# EAGLE design LB_BIT_3IN_3OUT-LARGE-v03(1_1x) (EAGLE 6.5.0)
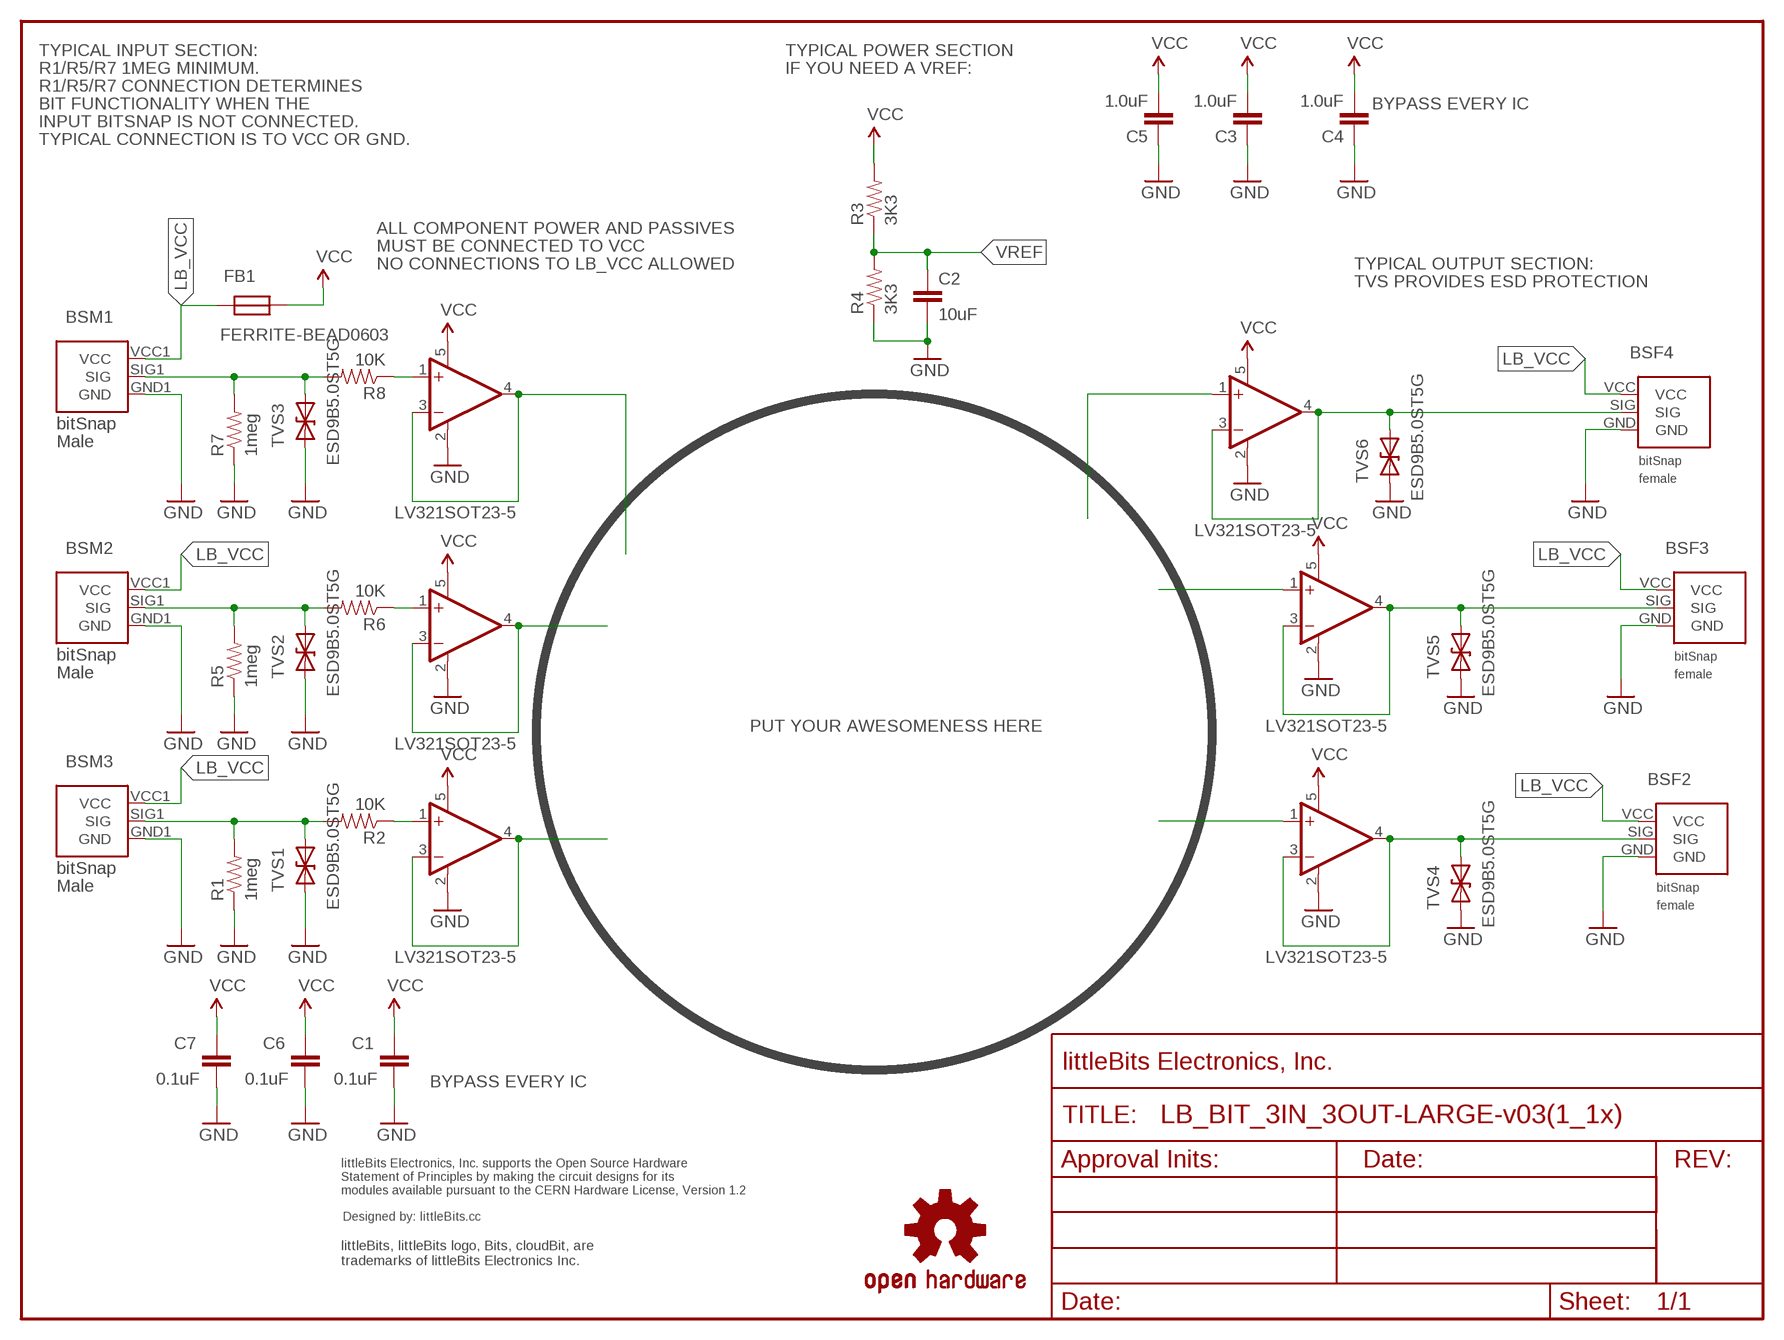
[diagram p0: schematic, sheet 1]

## Parts
BSF2  BITSNAP_V03_FEMALE  [BITSNAP_V03_FEMALE]
BSF3  BITSNAP_V03_FEMALE  [BITSNAP_V03_FEMALE]
BSF4  BITSNAP_V03_FEMALE  [BITSNAP_V03_FEMALE]
BSM1  BITSNAP_V03_MALE  [BITSNAP_V03_MALE]
BSM2  BITSNAP_V03_MALE  [BITSNAP_V03_MALE]
BSM3  BITSNAP_V03_MALE  [BITSNAP_V03_MALE]
C1  0.1uF  CAPCAP-0603  [CAP-0603]
C2  10uF  CAPCAP-0603  [CAP-0603]
C3  1.0uF  CAPCAP-0603  [CAP-0603]
C4  1.0uF  CAPCAP-0603  [CAP-0603]
C5  1.0uF  CAPCAP-0603  [CAP-0603]
C6  0.1uF  CAPCAP-0603  [CAP-0603]
C7  0.1uF  CAPCAP-0603  [CAP-0603]
FB1  FERRITE-BEAD0603  [R0603]
FRAME1  FRAME-LETTER  [FABDWG01-OHW]
R1  1meg  RESISTOR0603  [RES-0603]
R2  10K  RESISTOR0603  [RES-0603]
R3  3K3  RESISTOR0603  [RES-0603]
R4  3K3  RESISTOR0603  [RES-0603]
R5  1meg  RESISTOR0603  [RES-0603]
R6  10K  RESISTOR0603  [RES-0603]
R7  1meg  RESISTOR0603  [RES-0603]
R8  10K  RESISTOR0603  [RES-0603]
TVS1  ESD9B5.0ST5G  DIODE-TVSSOD-923  [SOD-923]
TVS2  ESD9B5.0ST5G  DIODE-TVSSOD-923  [SOD-923]
TVS3  ESD9B5.0ST5G  DIODE-TVSSOD-923  [SOD-923]
TVS4  ESD9B5.0ST5G  DIODE-TVSSOD-923  [SOD-923]
TVS5  ESD9B5.0ST5G  DIODE-TVSSOD-923  [SOD-923]
TVS6  ESD9B5.0ST5G  DIODE-TVSSOD-923  [SOD-923]
U1  LV321SOT23-5  [SOT23-5]
U2  LV321SOT23-5  [SOT23-5]
U3  LV321SOT23-5  [SOT23-5]
U4  LV321SOT23-5  [SOT23-5]
U5  LV321SOT23-5  [SOT23-5]
U6  LV321SOT23-5  [SOT23-5]
U$1  OSHWCREDIT  [OSHWCREDIT]
U$70  OSHW-LOGOL  [OSHW-LOGO-L]

## Nets
GND: BSF2.GND BSF3.GND BSF4.GND BSM1.GND1(GND) BSM2.GND1(GND) BSM3.GND1(GND) C1.2 C2.2 C3.1 C4.1 C5.1 C6.2 C7.2 R1.1 R4.1 R5.1 R7.1 TVS1.1(A) TVS2.1(A) TVS3.1(A) TVS4.1(A) TVS5.1(A) TVS6.1(A) U1.2(V-) U2.2(V-) U3.2(V-) U4.2(V-) U5.2(V-) U6.2(V-)
LB_VCC: BSF2.VCC BSF3.VCC BSF4.VCC BSM1.VCC1(VCC) BSM2.VCC1(VCC) BSM3.VCC1(VCC) FB1.2
N$1: R2.1 U1.1(+IN)
N$2: U1.3(-IN) U1.4(OUT)
N$3: BSM1.SIG1(SIG) R7.2 R8.2 TVS3.2(C)
N$4: BSM2.SIG1(SIG) R5.2 R6.2 TVS2.2(C)
N$5: BSM3.SIG1(SIG) R1.2 R2.2 TVS1.2(C)
N$6: U2.3(-IN) U2.4(OUT)
N$7: R6.1 U2.1(+IN)
N$8: U3.3(-IN) U3.4(OUT)
N$9: R8.1 U3.1(+IN)
N$10: U4.1(+IN)
N$11: U5.1(+IN)
N$12: U6.1(+IN)
SIG_OUT1: BSF4.SIG TVS6.2(C) U6.3(-IN) U6.4(OUT)
SIG_OUT2: BSF3.SIG TVS5.2(C) U5.3(-IN) U5.4(OUT)
SIG_OUT3: BSF2.SIG TVS4.2(C) U4.3(-IN) U4.4(OUT)
VCC: C1.1 C3.2 C4.2 C5.2 C6.1 C7.1 FB1.1 R3.2 U1.5(V+) U2.5(V+) U3.5(V+) U4.5(V+) U5.5(V+) U6.5(V+)
VREF: C2.1 R3.1 R4.2

## Notes on the sheet
- TYPICAL INPUT SECTION: | TYPICAL POWER SECTION
- R1/R5/R7 1MEG MINIMUM. | IF YOU NEED A VREF:
- R1/R5/R7 CONNECTION DETERMINES
- BIT FUNCTIONALITY WHEN THE | BYPASS EVERY IC
- INPUT BITSNAP IS NOT CONNECTED.
- TYPICAL CONNECTION IS TO VCC OR GND.
- ALL COMPONENT POWER AND PASSIVES
- MUST BE CONNECTED TO VCC
- NO CONNECTIONS TO LB_VCC ALLOWED | TYPICAL OUTPUT SECTION:
- TVS PROVIDES ESD PROTECTION
- PUT YOUR AWESOMENESS HERE
- BYPASS EVERY IC

## Library data of the parts
BSF2-BSF4 = bitSnap:BITSNAP_V03_FEMALE
BSM1-BSM3 = bitSnap:BITSNAP_V03_MALE
C1-C7 = LITTLEBITS:CAP
FB1 = LITTLEBITS:FERRITE-BEAD
FRAME1 = LITTLEBITS:FRAME-LETTER
R1-R8 = LITTLEBITS:RESISTOR
TVS1-TVS6 = LITTLEBITS:DIODE-TVS: Bidirectional Transient Voltage Suppression Diode: Device conducts in avalanche mode after reaching a part dependent voltage threshold. Used for limiting voltage spikes on ESD sensitive inputs and outputs.; IEC_ESD_PROT0: +/-18kV; LB_PN: ?; MPN: ESD9B5.0ST5G; V_CLAMP: ?; V_OPERATION: 5V
U1-U6 = LITTLEBITS:LV321
U$1 = LITTLEBITS:OSHWCREDIT
U$70 = LITTLEBITS:OSHW-LOGO: Open Source Hardware Logo This logo indicates the piece of hardware it is found on incorporates a OSHW license and/or adheres to the definition of open source hardware found here: http://freedomdefined.org/OSHW

## Net classes
0 default: width 0.254 mm, drill 0.61 mm, clearance 0.203 mm
1 vcc: width 0.254 mm

## Board
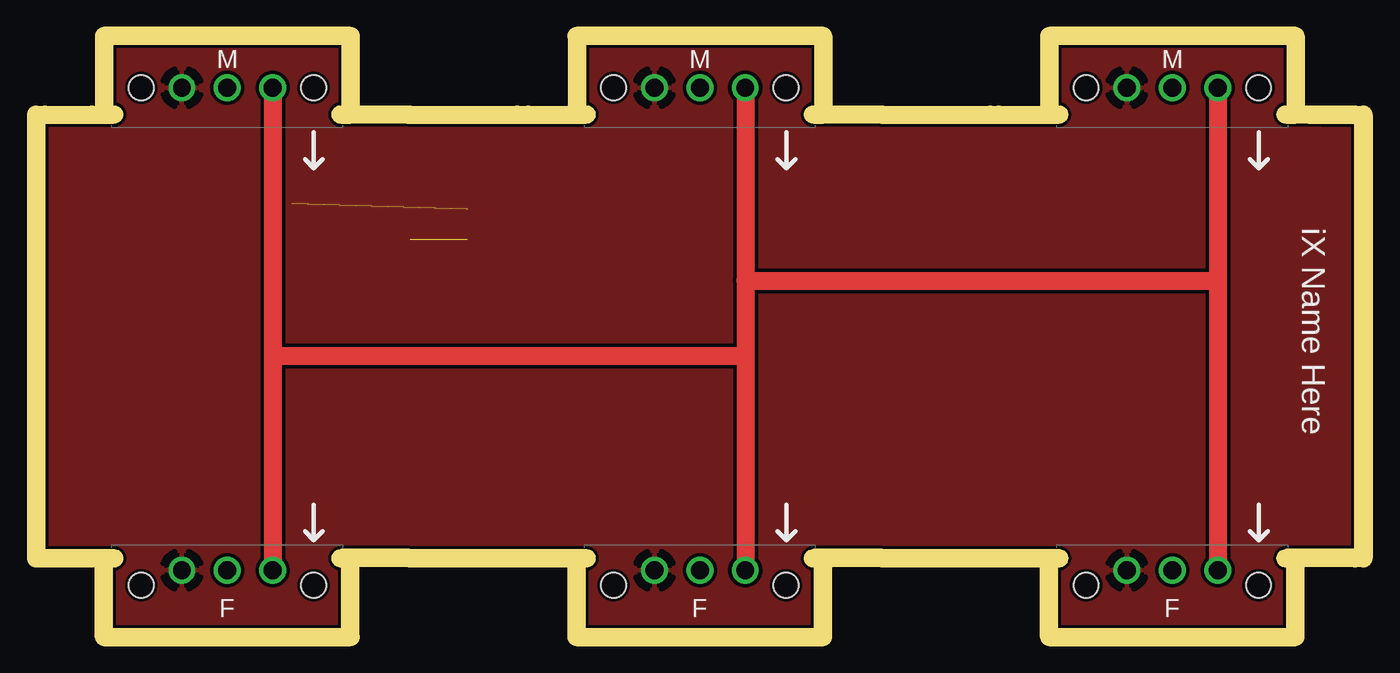
[diagram p1: board, top side]
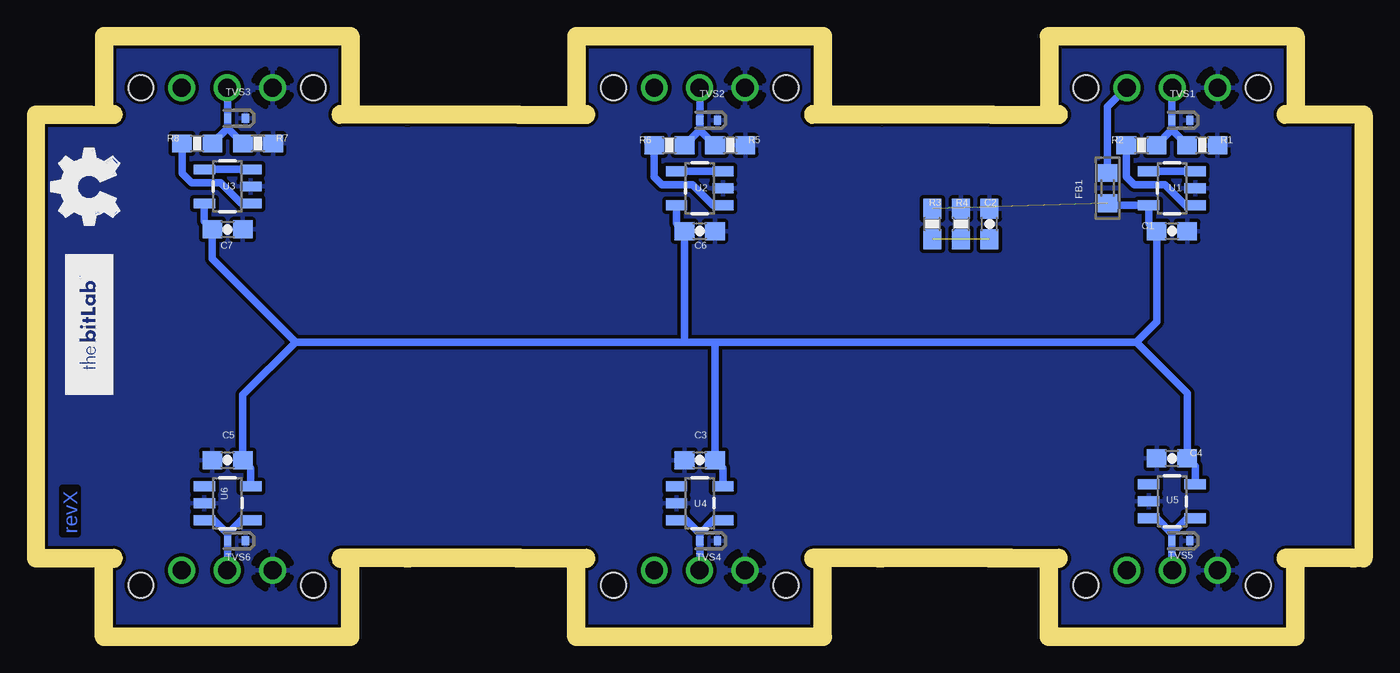
[diagram p2: board, bottom side, seen from below]

Size 73.25 x 32.61 mm. Coordinates in mm from the lower left corner, seen from the top.
Outline: 0,28.21 0,4.4
Outline: 73.25,4.4 73.25,28.21 71.45,28.21
Outline: 19.15,4.4 28.82,4.4
Outline: 46.6,4.4 53,4.4
Outline: 46.75,28.21 53.05,28.21
Outline: 20.35,28.21 26.45,28.21
Copper layers (1*16): Top 0.035mm / dielectric 1.5mm / Bottom 0.035mm
Design rules "littleBitsDRC": minimum track width 0.2mm, minimum drill 0.4mm, track to track 0.2mm, track to pad 0.2mm, pad to pad 0.2mm, via to via 0.2mm, smd to smd 0mil, copper to edge 0.2mm, drill to drill 0.2mm, minimum pad ring 0.2mm, minimum via ring 0.15mm, stop-mask expansion 0.1mm, vias tented up to drill 0mil, thermal gap 0.2mm
Milling: 10 lines

### Footprints (pad centres in the part's own frame; a part is rotated, then mirrored left to right if it is on the bottom)
BITSNAP_V03_FEMALE = drill 1: GND 4.065,3.44; SIG 6.605,3.44; VCC 9.145,3.44 | hole 1.4: 1.785,2.61; 11.425,2.61
BITSNAP_V03_MALE = drill 1: GND1 9.145,2.61; SIG1 6.605,2.61; VCC1 4.065,2.61 | hole 1.4: 1.785,2.61; 11.425,2.61
CAP-0603 = smd 1.1 x 1: 1 -0.85,0; 2 0.85,0
R0603 = smd 1 x 1.1: 1 -0.85,0; 2 0.85,0
RES-0603 = smd 1.1 x 1: 1 -0.85,0; 2 0.85,0
SOD-923 = smd 0.4 x 0.5: 1 -0.5,0; 2 0.5,0
SOT23-5 = smd 0.55 x 1.2: 1 -0.95,-1.3; 2 0,-1.3; 3 0.95,-1.3; 4 0.95,1.3; 5 -0.95,1.3

### Placement (x,y rotation side)
BSF2  30.02,-0.21 0 top
BSF3  3.6,-0.21 0 top
BSF4  56.45,-0.21 0 top
BSM1  69.66,32.82 180 top
BSM2  43.23,32.82 180 top
BSM3  16.81,32.82 180 top
C1  10.22,22.18 0 bottom
C2  20.42,22.58 90 bottom
C3  36.62,9.38 0 bottom
C4  10.22,9.48 0 bottom
C5  63.02,9.38 0 bottom
C6  36.62,22.18 0 bottom
C7  63.02,22.29 0 bottom
FB1  13.82,24.58 90 bottom
FRAME1  30.02,-6.82 0 top  (outside the outline)
R1  8.52,26.98 180 bottom
R2  11.92,26.98 0 bottom
R3  23.62,22.58 90 bottom
R4  22.02,22.58 270 bottom
R5  34.92,26.98 180 bottom
R6  38.33,26.98 0 bottom
R7  61.33,27.08 180 bottom
R8  64.72,27.08 0 bottom
TVS1  9.72,28.39 180 bottom
TVS2  36.12,28.39 180 bottom
TVS3  62.52,28.48 180 bottom
TVS4  36.12,4.88 180 bottom
TVS5  9.72,4.88 180 bottom
TVS6  62.52,4.88 180 bottom
U1  10.22,24.58 90 bottom
U2  36.62,24.58 90 bottom
U3  63.02,24.68 90 bottom
U4  36.62,6.99 270 bottom
U5  10.22,7.08 270 bottom
U6  63.02,6.99 270 bottom
U$1  -65.04,-68.75 0 top  (outside the outline)
U$2  [BITLAB-LOGO]  69.42,20.88 270 top
U$5  [OSHW_FILLX150_NOTEXT]  69.09,21.71 0 top
U$70  -5.54,-74.56 0 top  (outside the outline)

### Tracks (layer width: path | path; a pad name or v marks a point on that pad's centre or on a via)
GND
  pour Top: -0.98,-0.22 -0.98,32.79 73.92,32.79 73.92,-0.22
  pour Bottom: -0.98,-0.22 -0.98,32.79 73.92,32.79 73.92,-0.22
LB_VCC
  Top 1: BSM3.VCC1 12.75,15.18 | 12.75,15.18 BSF3.VCC | BSM2.VCC1 39.17,19.41 | 39.17,19.41 39.17,15.2 | 39.17,15.2 BSF2.VCC | BSM1.VCC1 65.59,19.38 | 65.59,19.38 BSF4.VCC | 39.17,19.41 65.56,19.41 65.59,19.38 | 39.17,15.2 12.76,15.2 12.75,15.18
  Bottom 0.406: BSM3.VCC1 13.82,29.13 FB1.2
N$1
  Bottom 0.406: U1.1 9.47,23.63 10.62,24.79 12.32,24.79 12.77,25.23 R2.1
N$2
  Bottom 0.406: U1.3 U1.4
N$3
  Bottom 0.406: BSM1.SIG1 63.02,30.18 TVS3.2 63.02,27.93 | 63.02,27.93 R8.2 | R7.2 63.02,27.93
N$4
  Bottom 0.406: BSM2.SIG1 TVS2.2 36.62,27.83 36.7,27.76 | 36.7,27.76 R6.2 | R5.2 36.55,27.76 36.7,27.76
N$5
  Bottom 0.406: BSM3.SIG1 10.22,30.19 TVS1.2 10.22,27.83 10.3,27.76 | 10.3,27.76 R2.2 | R1.2 10.15,27.76 10.3,27.76
N$6
  Bottom 0.406: U2.4 U2.3
N$7
  Bottom 0.406: U2.1 35.88,23.63 37.02,24.79 38.72,24.79 39.17,25.23 R6.1
N$8
  Bottom 0.406: U3.3 U3.4
N$9
  Bottom 0.406: R8.1 65.57,25.43 65.03,24.88 63.42,24.88 62.27,23.73 U3.1
SIG_OUT1
  Bottom 0.406: U6.4 62.27,6.03 63.02,5.28 | 63.02,5.28 TVS6.2 63.02,3.25 BSF4.SIG | 63.02,5.28 63.77,6.03 U6.3
SIG_OUT2
  Bottom 0.406: BSF3.SIG 10.22,3.23 TVS5.2 10.22,5.28 | 10.22,5.28 11.07,6.13 U5.3 | 10.22,5.28 9.38,6.13 U5.4
SIG_OUT3
  Bottom 0.406: BSF2.SIG TVS4.2 36.62,5.28 | U4.4 35.88,6.03 36.62,5.28 | 36.62,5.28 37.38,6.03 U4.3
VCC  (1 unrouted)
  Bottom 0.406: FB1.1 13.72,23.63 U1.5 11.52,22.63 C1.1 11.07,17.13 12.22,15.98 | U2.5 37.92,22.63 C6.1 37.48,16.04 37.52,15.98 | U3.5 64.32,22.73 C7.1 63.88,20.63 59.22,15.98 | U5.5 8.92,9.04 C4.2 9.38,13.13 12.22,15.98 | U4.5 35.32,8.93 C3.2 35.77,15.93 35.73,15.98 | U6.5 61.72,8.93 C5.2 62.17,13.04 59.22,15.98 | 12.22,15.98 35.73,15.98 | 35.73,15.98 37.52,15.98 | 37.52,15.98 59.22,15.98
VREF  (2 unrouted)

### Text on the board
Bottom: revX
tPlace: iX Name Here